# EAGLE design filterboardsSMD-3 (EAGLE 9.4.0)
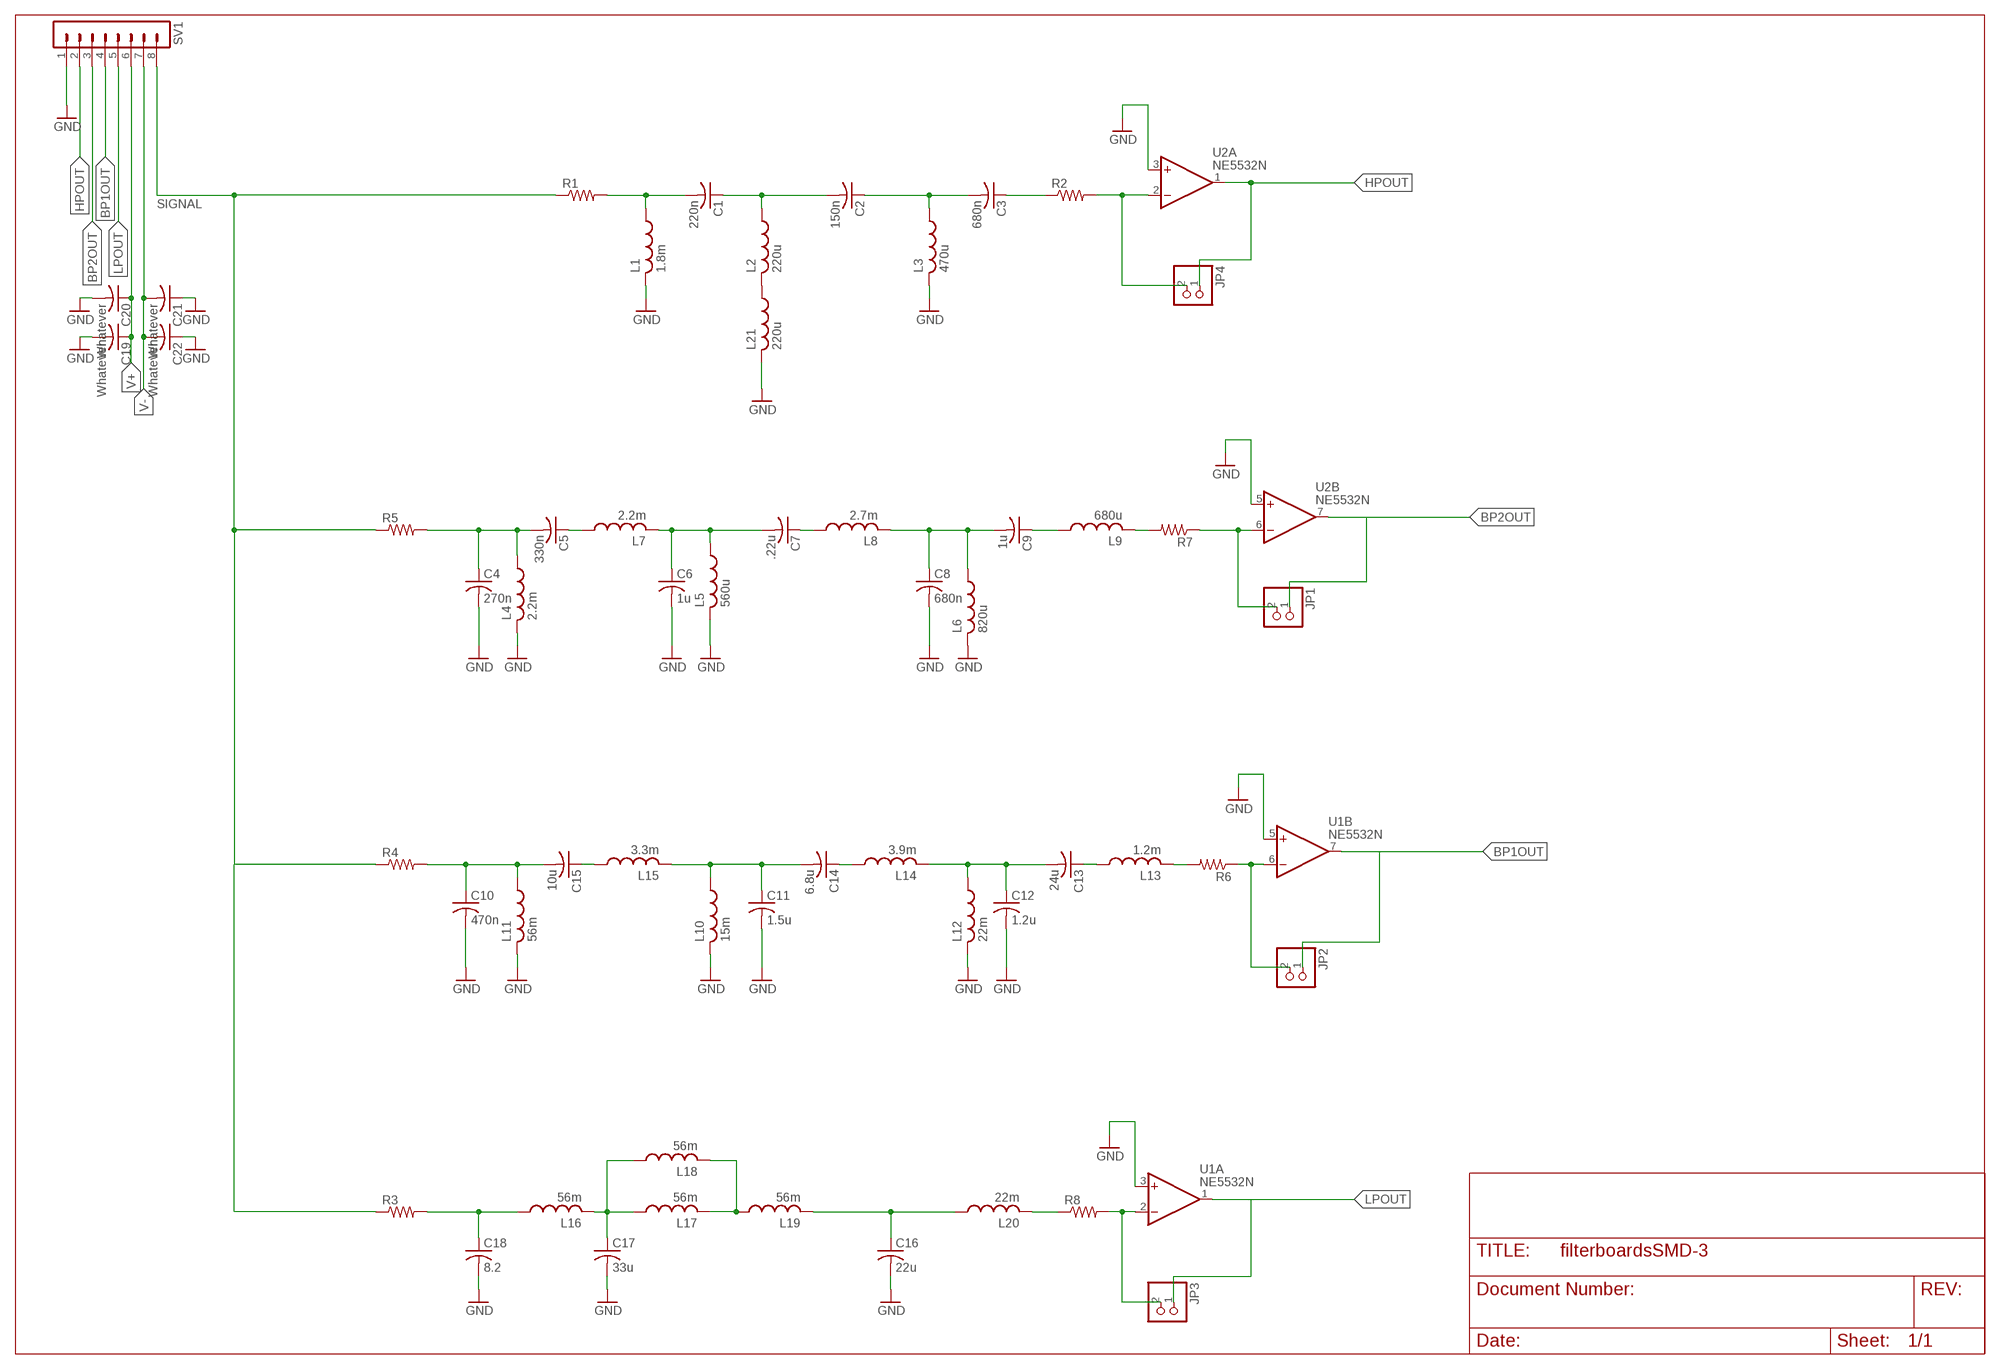
[diagram p0: schematic, sheet 1]

## Parts
C1  220n  C-USC0805K  [C0805K]
C2  150n  C-US025-030X050  [C025-030X050]
C3  680n  C-US025-030X050  [C025-030X050]
C4  270n  C-US025-030X050  [C025-030X050]
C5  330n  C-US025-030X050  [C025-030X050]
C6  1u  C-USC1210K  [C1210K]
C7  .22u  C-USC0805K  [C0805K]
C8  680n  C-US025-030X050  [C025-030X050]
C9  1u  C-USC1210K  [C1210K]
C10  470n  C-US025-030X050  [C025-030X050]
C11  1.5u  C-USC0805K  [C0805K]
C12  1.2u  C-US102-054X133  [C102-054X133]
C13  24u  C-US025-030X050  [C025-030X050]
C14  6.8u  C-US025-030X050  [C025-030X050]
C15  10u  C-USC1206K  [C1206K]
C16  22u  C-US025-030X050  [C025-030X050]
C17  33u  C-US025-030X050  [C025-030X050]
C18  8.2  C-USC1210K  [C1210K]
C19  Whatever  C-US050-025X075  [C050-025X075]
C20  Whatever  C-US050-025X075  [C050-025X075]
C21  Whatever  C-US050-025X075  [C050-025X075]
C22  Whatever  C-US050-025X075  [C050-025X075]
JP1  PINHD-1X2  [1X02]
JP2  PINHD-1X2  [1X02]
JP3  PINHD-1X2  [1X02]
JP4  PINHD-1X2  [1X02]
L1  1.8m  L-US0207/5V  [0207/5V]
L2  220u  L-US0207/5V  [0207/5V]
L3  470u  L-US0207/5V  [0207/5V]
L4  2.2m  L-US0207/5V  [0207/5V]
L5  560u  L-US0207/5V  [0207/5V]
L6  820u  L-US0207/5V  [0207/5V]
L7  2.2m  L-US0207/5V  [0207/5V]
L8  2.7m  L-US0207/5V  [0207/5V]
L9  680u  L-US0207/5V  [0207/5V]
L10  15m  L-US0207/5V  [0207/5V]
L11  56m  L-US0207/5V  [0207/5V]
L12  22m  L-US0207/5V  [0207/5V]
L13  1.2m  L-US0207/5V  [0207/5V]
L14  3.9m  L-US0207/5V  [0207/5V]
L15  3.3m  L-US0207/5V  [0207/5V]
L16  56m  L-US0207/5V  [0207/5V]
L17  56m  L-US0207/5V  [0207/5V]
L18  56m  L-US0207/5V  [0207/5V]
L19  56m  L-US0207/5V  [0207/5V]
L20  22m  L-US0207/5V  [0207/5V]
L21  220u  L-US0207/5V  [0207/5V]
R1  R-US_0204/7  [0204/7]
R2  R-US_0204/7  [0204/7]
R3  R-US_0204/7  [0204/7]
R4  R-US_0204/7  [0204/7]
R5  R-US_0204/7  [0204/7]
R6  R-US_0204/7  [0204/7]
R7  R-US_0204/7  [0204/7]
R8  R-US_0204/7  [0204/7]
SV1  MA08-1  [MA08-1]
U1  NE5532N  [DIL08]
U2  NE5532N  [DIL08]

## Nets
BP1OUT: JP2.1 SV1.4 U1.7(B:OUT)
BP2OUT: JP1.1 SV1.3 U2.7(B:OUT)
GND: C4.2 C6.2 C8.2 C10.2 C11.2 C12.2 C16.2 C17.2 C18.2 C19.2 C20.2 C21.1 C22.1 L1.2 L3.2 L4.2 L5.2 L6.2 L10.2 L11.2 L12.2 L21.2 SV1.1 U1.3(A:+IN) U1.5(B:+IN) U2.5(B:+IN)
HPOUT: JP4.1 SV1.2 U2.1(A:OUT)
LPOUT: JP3.1 SV1.5 U1.1(A:OUT)
N$1: C1.2 L1.1 R1.2
N$2: C1.1 C2.2 L2.1
N$3: C2.1 C3.2 L3.1
N$4: C3.1 R2.1
N$5: C4.1 C5.2 L4.1 R5.2
N$6: C5.1 L7.1
N$7: C6.1 C7.2 L5.1 L7.2
N$8: JP3.2 R8.2 U1.2(A:-IN)
N$9: C7.1 L8.1
N$10: C8.1 C9.2 L6.1 L8.2
N$11: C9.1 L9.1
N$12: JP2.2 R6.1 U1.6(B:-IN)
N$13: JP1.2 R7.1 U2.6(B:-IN)
N$14: L9.2 R7.2
N$15: JP4.2 R2.2 U2.2(A:-IN)
N$16: C10.1 C15.2 L11.1 R4.2
N$17: C15.1 L15.1
N$18: C11.1 C14.2 L10.1 L15.2
N$19: L2.2 L21.1
N$20: C14.1 L14.1
N$21: C12.1 C13.2 L12.1 L14.2
N$22: C13.1 L13.1
N$23: L13.2 R6.2
N$24: C18.1 L16.1 R3.2
N$25: C17.1 L16.2 L17.1 L18.1
N$27: L17.2 L18.2 L19.1
N$28: C16.1 L19.2 L20.1
N$29: L20.2 R8.1
N$34: U2.3(A:+IN) ; supply symbol labelled GND
SIGNAL: R1.1 R3.1 R4.1 R5.1 SV1.8
V+: C19.1 C20.1 SV1.6
V-: C21.2 C22.2 SV1.7

## Power pins joined to a net without a drawn wire
V+: U1.8(P:V+) U2.8(P:V+)
V-: U1.4(P:V-) U2.4(P:V-)

## Library data of the parts
C1-C22 = rcl:C-US: CAPACITOR, American symbol; SPICEPREFIX: C
JP1-JP4 = pinhead:PINHD-1X2: PIN HEADER
L1-L21 = rcl:L-US: INDUCTOR, American symbol; SPICEPREFIX: L
R1-R8 = rcl:R-US_: RESISTOR, American symbol; SPICEPREFIX: R
SV1 = con-lstb:MA08-1: PIN HEADER; OC_FARNELL: unknown; OC_NEWARK: unknown
U1 U2 = op-amp:NE5532: OP-AMP

## Board
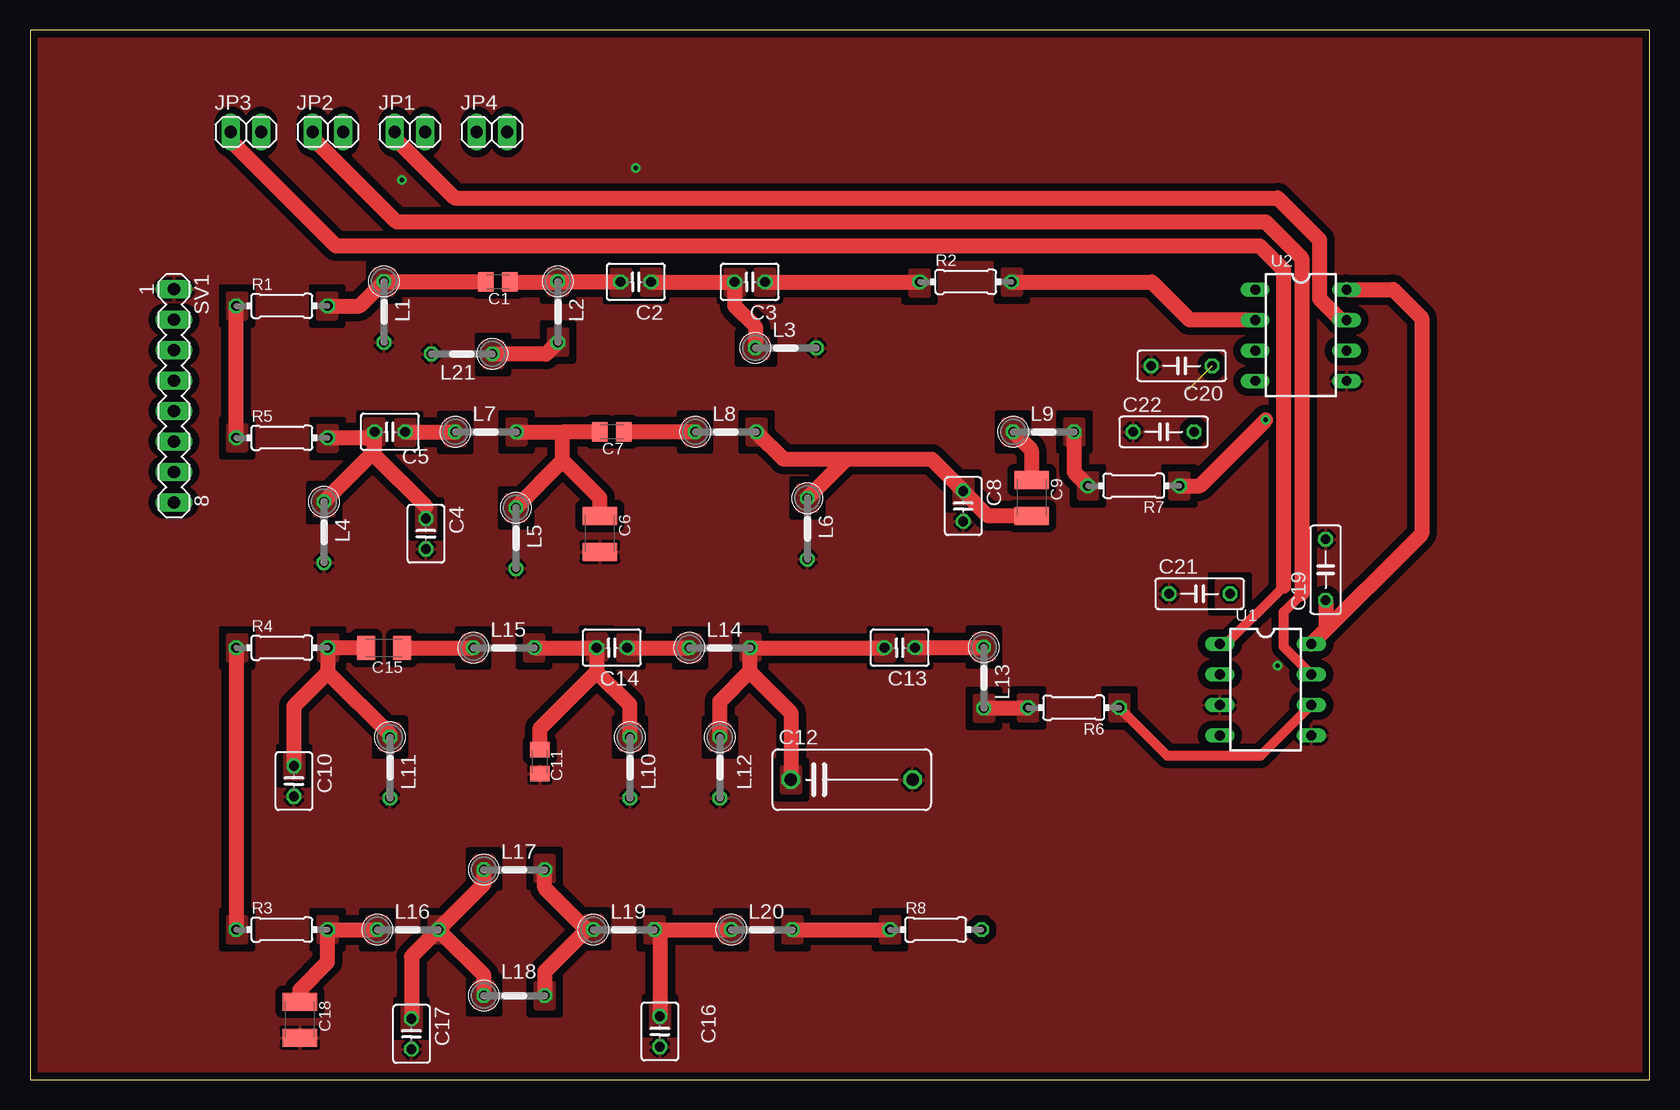
[diagram p1: board, top side]
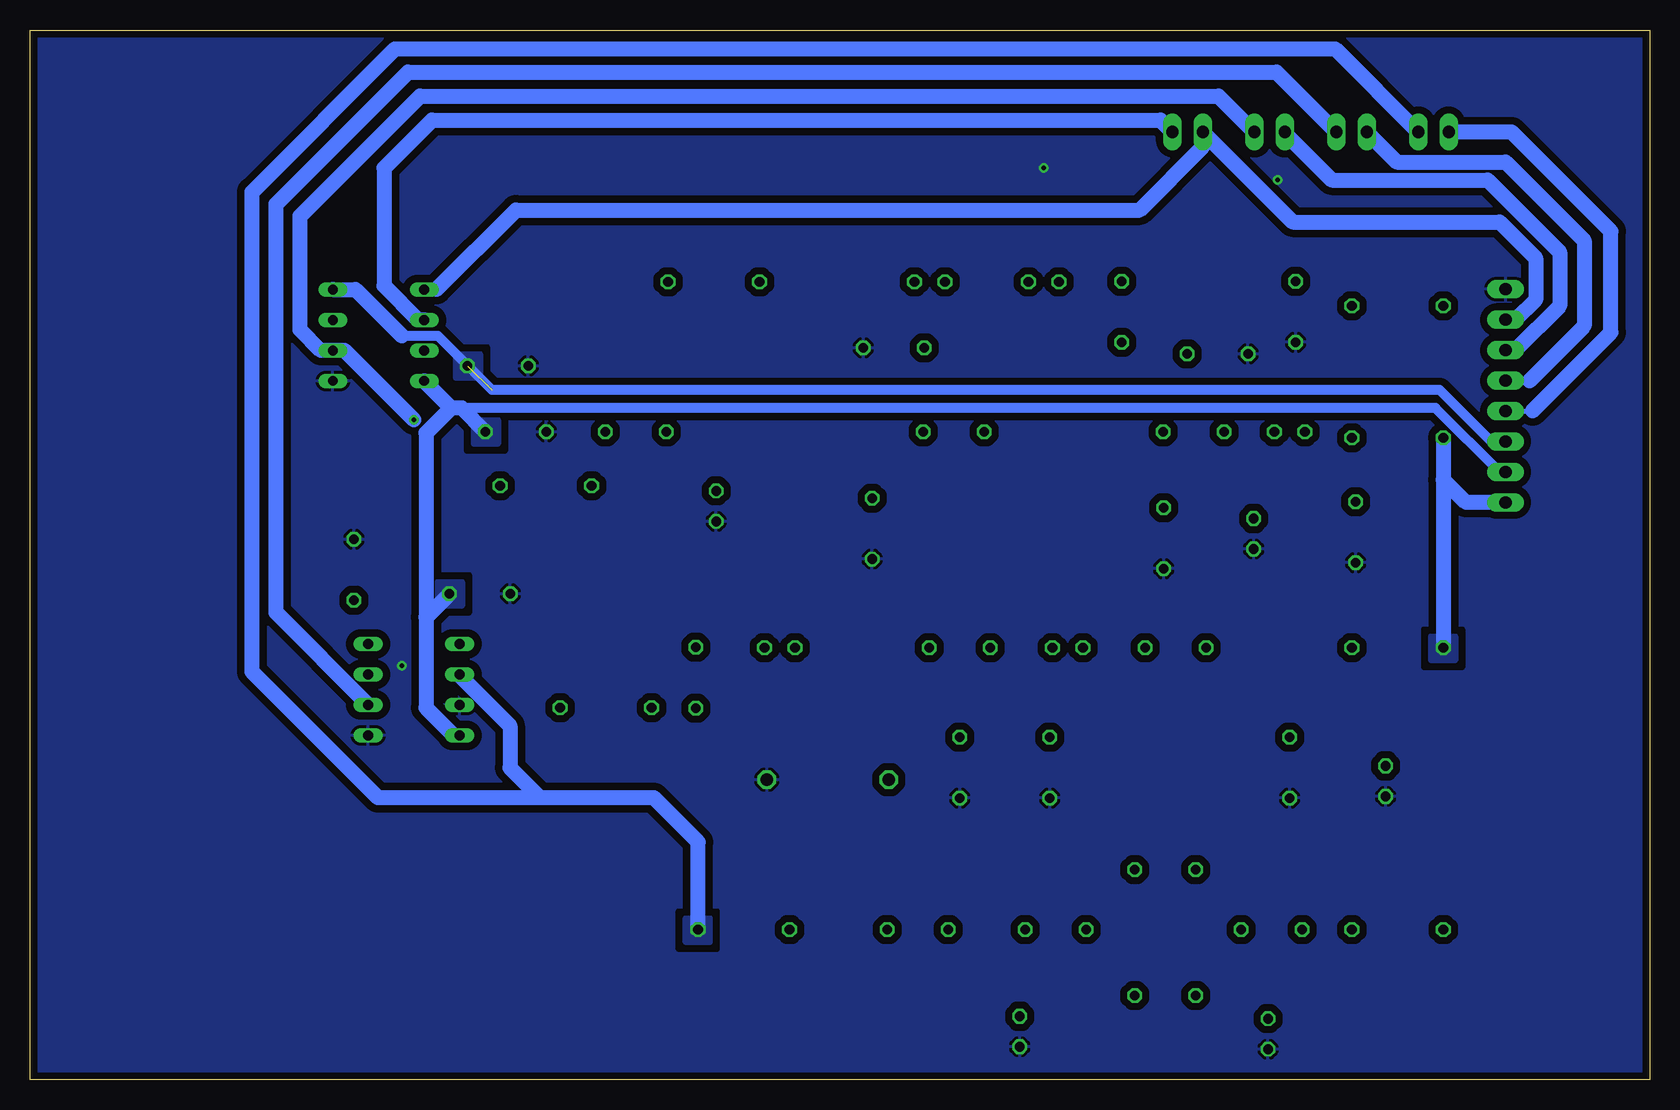
[diagram p2: board, bottom side, seen from below]

Size 135 x 87.5 mm. Coordinates in mm from the lower left corner, seen from the top.
Outline: 0,0 135,0 135,87.5 0,87.5 0,0
Copper layers (1*16): Top 0.0178mm / dielectric 59mil / Bottom 0.0178mm
Design rules "epl-lpkf": minimum track width 8mil, minimum drill 0.35mm, track to track 8mil, track to pad 8mil, pad to pad 8mil, via to via 8mil, smd to smd 8mil, copper to edge 15mil, drill to drill 15mil, minimum pad ring 8mil, minimum via ring 8mil, stop-mask expansion 3mil, vias tented up to drill 0mil, thermal gap 10mil

### Footprints (pad centres in the part's own frame; a part is rotated, then mirrored left to right if it is on the bottom)
C0805K = smd 1.3 x 1.6: 1 -1,0; 2 1,0
C025-030X050 = drill 0.813 octagon: 1 -1.27,0; 2 1.27,0
C1210K = smd 1.5 x 2.9: 1 -1.5,0; 2 1.5,0
C102-054X133 = drill 1.016 octagon: 1 -5.08,0; 2 5.08,0
C1206K = smd 1.5 x 2: 1 -1.5,0; 2 1.5,0
C050-025X075 = drill 0.813 octagon: 1 -2.54,0; 2 2.54,0
1X02 = drill 1.016 long: 1 -1.27,0; 2 1.27,0
0207/5V = drill 0.813 octagon: 1 -2.54,0; 2 2.54,0
0204/7 = drill 0.813 octagon: 1 -3.81,0; 2 3.81,0
MA08-1 = drill 1.016 long: 1 -8.89,0; 2 -6.35,0; 3 -3.81,0; 4 -1.27,0; 5 1.27,0; 6 3.81,0; 7 6.35,0; 8 8.89,0
DIL08 = drill 0.813 long: 1 -3.81,-3.81; 2 -1.27,-3.81; 3 1.27,-3.81; 4 3.81,-3.81; 5 3.81,3.81; 6 1.27,3.81; 7 -1.27,3.81; 8 -3.81,3.81

### Placement (x,y rotation side)
C1  39,66.5 180 top
C2  50.5,66.5 180 top
C3  60,66.5 180 top
C4  33,45.5 270 top
C5  30,54 180 top
C6  47.5,45.5 270 top
C7  48.5,54 180 top
C8  77.8,47.8 270 top
C9  83.5,48.5 270 top
C10  22,24.87 270 top
C11  42.5,26.5 270 top
C12  68.5,25 0 top
C13  72.5,36 180 top
C14  48.5,36 180 top
C15  29.5,36 180 top
C16  52.5,4 270 top
C17  31.8,3.8 270 top
C18  22.5,5 270 top
C19  108,42.5 90 top
C20  96,59.5 180 top
C21  97.5,40.5 0 top
C22  94.5,54 0 top
JP1  31.67,79 0 top
JP2  24.83,79 0 top
JP3  18,79 0 top
JP4  38.5,79 0 top
L1  29.5,64 270 top
L2  44,64 270 top
L3  63,61 0 top
L4  24.5,45.63 270 top
L5  40.5,45.13 270 top
L6  64.8,45.93 270 top
L7  38,54 0 top
L8  58,54 0 top
L9  84.5,54 0 top
L10  50,26 270 top
L11  30,26 270 top
L12  57.5,26 270 top
L13  79.5,33.5 270 top
L14  57.5,36 0 top
L15  39.5,36 0 top
L16  31.5,12.5 0 top
L17  40.37,17.5 0 top
L18  40.37,7 0 top
L19  49.5,12.5 0 top
L20  61,12.5 0 top
L21  36,60.5 180 top
R1  21,64.5 0 top
R2  78,66.5 0 top
R3  21,12.5 0 top
R4  21,36 0 top
R5  21,53.5 0 top
R6  87,31 180 top
R7  92,49.5 180 top
R8  75.5,12.5 0 top
SV1  12,57 270 top
U1  103,32.5 270 top
U2  105.95,62.05 270 top

### Tracks (layer width: path | path; a pad name or v marks a point on that pad's centre or on a via)
BP1OUT
  Top 0.813: U1.7 104.5,36.08 104.5,39 106,40.5
  Top 1.27: 106,40.5 106,68.5 103,71.5 30.56,71.5 23.56,78.5 JP2.1
  Bottom 0.406: 10,58.27 SV1.4
  Bottom 1.27: 10,58.27 5.44,62.83 5.44,69.94 12,76.5 21.06,76.5 JP2.1
BP2OUT
  Top 1.27: U2.7 109.26,63.32 107.5,65.08 107.5,70 104,73.5 35.4,73.5 30.4,78.5 JP1.1
  Bottom 0.406: 11.19,60.81 SV1.3 | JP1.1 30.4,78.9
  Bottom 1.27: 11.19,60.81 7.5,64.5 7.5,69 13.5,75 26.5,75 30.4,78.9
GND  (via drill 0.35)
  other vias: 50.5,76 31,75 104,34.5
  pour Top (isolate 0.61, rank 2): -0.5,87.5 -0.5,0 135,0 135,87.5
  pour Bottom (isolate 0.61, rank 2): -0.5,87.5 -0.5,0 135,0 135,87.5
HPOUT
  Bottom 0.406: 11.15,63.35 SV1.2 | U2.1 101.14,65.86 | 37.23,77.77 JP4.1
  Bottom 1.27: 11.15,63.35 9.5,65 9.5,68.5 12.5,71.5 29.73,71.5 JP4.1 | 101.14,65.86 94.5,72.5 42.5,72.5 37.23,77.77
LPOUT
  Top 0.406: U1.1 99.69,36.31 | 16.73,78.27 JP3.1
  Top 0.813: 99.69,36.31 104.5,41.12
  Top 1.27: 104.5,41.12 104.5,67.5 102.5,69.5 25.5,69.5 16.73,78.27
  Bottom 0.406: SV1.5 9.77,55.73
  Bottom 1.27: 9.77,55.73 3.22,62.28 3.22,70.72 11.5,79 JP3.1
N$1
  Top 0.406: 37.96,66.54 C1.2
  Top 1.27: R1.2 27.46,64.5 L1.1 37.96,66.54
  pour Top (no thermals): 24,65.5 24,63.5 25.5,63.5 25.5,65.5
  pour Top (no thermals): 28.75,67.5 28.75,65.5 30.25,65.5 30.25,67.5
N$2
  Top 0.406: 43.96,66.5 L2.1
  Top 1.27: C2.2 44,66.5 | C1.1 43.96,66.5
  pour Top (no thermals): 43.25,67.5 43.25,65.5 44.75,65.5 44.75,67.5
  pour Top (no thermals): 48.5,67.45 48.5,65.45 50,65.45 50,67.45
N$3
  Top 1.27: C2.1 C3.2 58.73,64.5 60.46,62.77 L3.1
  pour Top (no thermals): 51,67.5 51,65.5 52.5,65.5 52.5,67.5
  pour Top (no thermals): 59.5,60.25 61.5,60.25 61.5,61.75 59.5,61.75
  pour Top (no thermals): 58,67.45 58,65.45 59.5,65.45 59.5,67.45
N$4
  Top 1.27: C3.1 R2.1
  pour Top (no thermals): 60.5,67.5 60.5,65.5 62,65.5 62,67.5
  pour Top (no thermals): 73.4,67.4 73.4,65.4 74.9,65.4 74.9,67.4
N$5
  Top 0.406: C4.1 33,47.77 | 28.73,52.04 28.55,52.22
  Top 1.27: R5.2 28.23,53.5 C5.2 28.73,52.04 33,47.77 | L4.1 28.55,52.22
  pour Top (no thermals): 27.95,55 27.95,53 29.45,53 29.45,55
  pour Top (no thermals): 23.75,49.1 23.75,47.1 25.25,47.1 25.25,49.1
  pour Top (no thermals): 32.25,47.75 32.25,45.75 33.75,45.75 33.75,47.75
  pour Top (no thermals): 24.05,54.45 24.05,52.45 25.55,52.45 25.55,54.45
N$6
  Top 1.27: C5.1 L7.1
  pour Top (no thermals): 34.7,54.95 34.7,52.95 36.2,52.95 36.2,54.95
  pour Top (no thermals): 30.5,54.95 30.5,52.95 32,52.95 32,54.95
N$7
  Top 0.406: 44.42,53.92 44.5,54
  Top 1.27: L5.1 44.42,51.58 | C6.1 47.5,48.5 44.42,51.58 | L7.2 44.5,54 C7.2 | 44.42,51.58 44.42,53.92
  pour Top (no thermals): 39.75,48.65 39.75,46.65 41.25,46.65 41.25,48.65
  pour Top (no thermals): 39.8,55 39.8,53 41.3,53 41.3,55
N$8
  Bottom 0.406: U1.2 99.19,33.69
  Bottom 1.27: 92.5,23.5 83,23.5 79.31,19.81 R8.2 | 92.5,23.5 106,23.5 116.5,34 116.5,74 104.57,85.93 26.2,85.93 JP3.2 | 99.19,33.69 95,29.5 95,26 92.5,23.5
  pour Bottom (no thermals): 78.35,11.45 80.35,11.45 80.35,13.45 78.35,13.45
N$9
  Top 1.27: L8.1 C7.1
  pour Top (no thermals): 54.7,55 54.7,53 56.2,53 56.2,55
N$10
  Top 1.27: L6.1 68.03,51.7 | 68.03,51.7 75.17,51.7 C8.1 79.87,47 C9.2 | L8.2 62.84,51.7 68.03,51.7
  pour Top (no thermals): 77.05,50.05 77.05,48.05 78.55,48.05 78.55,50.05
  pour Top (no thermals): 59.8,55 59.8,53 61.3,53 61.3,55
  pour Top (no thermals): 64.05,49.5 64.05,47.5 65.55,47.5 65.55,49.5
N$11
  Top 0.406: C9.1 83.46,50.04
  Top 1.27: L9.1 83.46,52.5 83.46,50.04
  pour Top (no thermals): 81.2,55 81.2,53 82.7,53 82.7,55
N$12
  Top 0.813: R6.1 94.81,27 102.58,27 U1.6
  Bottom 1.27: U1.6 114.5,38.92 114.5,73 103.5,84 31.1,84 JP2.2
  pour Top (no thermals): 90.05,32 90.05,30 91.55,30 91.55,32
N$13  (via drill 0.35)
  Top 1.27: R7.1 97.5,49.5 v103,55
  Bottom 1.27: v103,55 108.78,60.78 U2.6 110.76,60.78 112.5,62.52 112.5,72 102.5,82 35.94,82 JP1.2
  pour Top (no thermals): 95.05,50.5 95.05,48.5 96.55,48.5 96.55,50.5
N$14
  Top 1.27: L9.2 87.04,50.65 R7.2
  pour Top (no thermals): 87.45,50.5 87.45,48.5 88.95,48.5 88.95,50.5
  pour Top (no thermals): 86.3,55 86.3,53 87.8,53 87.8,55
N$15
  Top 1.27: R2.2 93.5,66.5 96.65,63.35 102.11,63.35 U2.2
  Bottom 1.27: U2.2 102.64,63.32 105.5,66.18 105.5,76 101.5,80 40.77,80 JP4.2
  pour Top (no thermals): 81.1,67.5 81.1,65.5 82.6,65.5 82.6,67.5
N$16
  Top 0.406: 30,28.76 L11.1
  Top 1.27: C10.1 22,31.14 24.81,33.95 | 24.81,33.95 R4.2 C15.2 | 24.81,33.95 30,28.76
  pour Top (no thermals): 24.1,37 24.1,35 25.6,35 25.6,37
  pour Top (no thermals): 21.25,27.15 21.25,25.15 22.75,25.15 22.75,27.15
  pour Top (no thermals): 29.25,29.55 29.25,27.55 30.75,27.55 30.75,29.55
N$17
  Top 1.27: C15.1 L15.1
  pour Top (no thermals): 36.2,37 36.2,35 37.7,35 37.7,37
N$18
  Top 0.406: 47.23,34 47.24,33.99 | 50,31.23 | C11.1
  Top 1.27: L15.2 C14.2 47.23,34 | L10.1 50,31.23 47.24,33.99 42.5,29.25 C11.1
  pour Top (no thermals): 41.25,37 41.25,35 42.75,35 42.75,37
  pour Top (no thermals): 46.5,37.05 46.5,35.05 48,35.05 48,37.05
  pour Top (no thermals): 49.25,29.55 49.25,27.55 50.75,27.55 50.75,29.55
N$19
  Top 0.406: L21.1 38.58,60.46
  Top 1.27: L2.2 43,60.46 38.58,60.46
  pour Top (no thermals): 43.25,62.5 43.25,60.5 44.75,60.5 44.75,62.5
  pour Top (no thermals): 37.85,61.45 37.85,59.45 39.35,59.45 39.35,61.45
N$20
  Top 1.27: C14.1 L14.1
  pour Top (no thermals): 49.05,37 49.05,35 50.55,35 50.55,37
  pour Top (no thermals): 54.25,37 54.25,35 55.75,35 55.75,37
N$21
  Top 0.406: 59.98,34.02 60.04,34.08
  Top 1.27: C13.2 L14.2 60.04,34.08 | L12.1 57.5,31.54 59.98,34.02 63.42,30.58 C12.1
  pour Top (no thermals): 59.3,37.05 59.3,35.05 60.8,35.05 60.8,37.05
  pour Top (no thermals): 56.75,29.55 56.75,27.55 58.25,27.55 58.25,29.55
  pour Top (no thermals): 62.7,26 62.7,24 64.2,24 64.2,26
  pour Top (no thermals): 70.5,37 70.5,35 72,35 72,37
N$22
  Top 0.406: L13.1 79.46,36
  Top 1.27: 79.46,36 C13.1
  pour Top (no thermals): 73,37 73,35 74.5,35 74.5,37
  pour Top (no thermals): 78.75,37.05 78.75,35.05 80.25,35.05 80.25,37.05
N$23
  Top 0.406: 83.15,30.96 R6.2
  Top 1.27: L13.2 83.15,30.96
  pour Top (no thermals): 78.75,31.95 78.75,29.95 80.25,29.95 80.25,31.95
  pour Top (no thermals): 82.45,32 82.45,30 83.95,30 83.95,32
N$24
  Top 1.27: L16.1 R3.2 24.81,9.81 22.5,7.5 C18.1
  pour Top (no thermals): 24.05,13.5 24.05,11.5 25.55,11.5 25.55,13.5
  pour Top (no thermals): 28.2,13.5 28.2,11.5 29.7,11.5 29.7,13.5
N$25
  Top 1.27: L16.2 37.83,16.29 L17.1 | L16.2 31.8,10.26 C17.1 | L16.2 37.83,8.71 L18.1
  pour Top (no thermals): 33.3,13.5 33.3,11.5 34.8,11.5 34.8,13.5
  pour Top (no thermals): 37.1,8.05 37.1,6.05 38.6,6.05 38.6,8.05
  pour Top (no thermals): 31.05,6.1 31.05,4.1 32.55,4.1 32.55,6.1
  pour Top (no thermals): 37.1,18.55 37.1,16.55 38.6,16.55 38.6,18.55
N$27
  Top 0.406: L19.1 46.41,12.5
  Top 1.27: L18.2 42.91,9 46.41,12.5 42.91,16 L17.2
  pour Top (no thermals): 42.15,8 42.15,6 43.65,6 43.65,8
  pour Top (no thermals): 46.2,13.55 46.2,11.55 47.7,11.55 47.7,13.55
  pour Top (no thermals): 42.15,18.6 42.15,16.6 43.65,16.6 43.65,18.6
N$28
  Top 0.406: L19.2 52.5,12.5
  Top 1.27: L20.1 52.5,12.5 C16.1
  pour Top (no thermals): 51.75,6.3 51.75,4.3 53.25,4.3 53.25,6.3
  pour Top (no thermals): 51.3,13.5 51.3,11.5 52.8,11.5 52.8,13.5
  pour Top (no thermals): 57.7,13.5 57.7,11.5 59.2,11.5 59.2,13.5
N$29
  Top 1.27: L20.2 R8.1
  pour Top (no thermals): 62.8,13.5 62.8,11.5 64.3,11.5 64.3,13.5
  pour Top (no thermals): 70.95,13.5 70.95,11.5 72.45,11.5 72.45,13.5
SIGNAL
  Top 1.27: R5.1 R1.1 | R4.1 R3.1
  Bottom 1.27: R5.1 17.19,50 | 17.19,50 R4.1 | SV1.8 15.3,48.11 17.19,50
  pour Top (no thermals): 16.5,37 16.5,35 18,35 18,37
  pour Top (no thermals): 16.5,13.5 16.5,11.5 18,11.5 18,13.5
  pour Top (no thermals): 16.5,54.5 16.5,52.5 18,52.5 18,54.5
  pour Top (no thermals): 16.5,65.5 16.5,63.5 18,63.5 18,65.5
  pour Bottom (no thermals): 16.2,34.95 18.2,34.95 18.2,36.95 16.2,36.95
V+  (1 unrouted)
  Top 0.406: 108,37.5 U1.8
  Top 1.27: U2.8 113.64,65.86 116,63.5 116,45.5 U1.8 | C19.1 108,37.5
  Bottom 0.813: SV1.6 13.19,53.19 17.5,57.5 96.5,57.5 101,62 104,62
  Bottom 1.27: U2.8 107.86,65.86 104,62
  pour Bottom (no thermals): 97.5,58.5 99.5,58.5 99.5,60.5 97.5,60.5
V+2
  pour Top (no thermals): 101,39.5 99,39.5 99,41.5 101,41.5
V-
  Bottom 0.406: 99.69,28.69 U1.4 | 99,55.96 99,56
  Bottom 0.813: 99,56 17.85,56 12.5,50.65 SV1.7
  Bottom 1.27: 99.9,56 U2.4 | 99,56 99.9,56 | 99.9,56 102,53.9 102,38.54 | 102,38.54 102,31 99.69,28.69 | C22.2 99,55.96 | C21.2 102,38.54
  pour Bottom (no thermals): 99,39.5 101,39.5 101,41.5 99,41.5
  pour Bottom (no thermals): 96,53 98,53 98,55 96,55